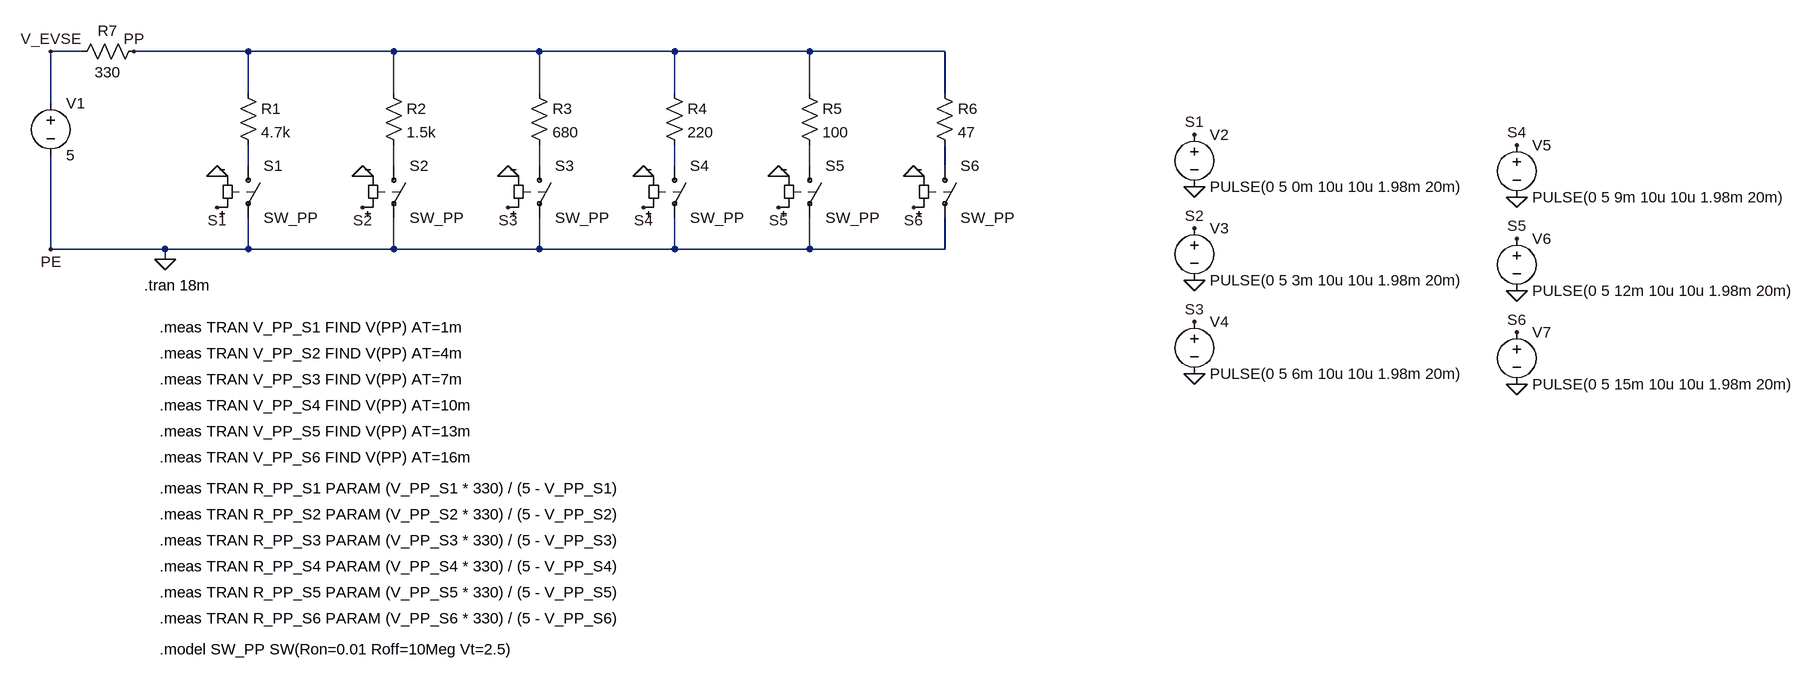
[diagram p0: schematic teste2.asc]
teste2.asc, the LTspice schematic file:
Version 4.1
SHEET 1 2472 920
WIRE -192 -16 -240 -16
WIRE 64 -16 -112 -16
WIRE 288 -16 64 -16
WIRE 512 -16 288 -16
WIRE 720 -16 512 -16
WIRE 928 -16 720 -16
WIRE 1136 -16 928 -16
WIRE 64 48 64 -16
WIRE 288 48 288 -16
WIRE 512 48 512 -16
WIRE 720 48 720 -16
WIRE 928 48 928 -16
WIRE 1136 48 1136 -16
WIRE -240 64 -240 -16
WIRE 64 160 64 128
WIRE 288 160 288 128
WIRE 512 160 512 128
WIRE 720 160 720 128
WIRE 928 160 928 128
WIRE 1136 160 1136 128
WIRE -240 288 -240 144
WIRE -64 288 -240 288
WIRE 64 288 64 240
WIRE 64 288 -64 288
WIRE 288 288 288 240
WIRE 288 288 64 288
WIRE 512 288 512 240
WIRE 512 288 288 288
WIRE 720 288 720 240
WIRE 720 288 512 288
WIRE 928 288 928 240
WIRE 928 288 720 288
WIRE 1136 288 1136 240
WIRE 1136 288 928 288
WIRE -64 304 -64 288
FLAG -64 304 0
FLAG -240 -16 V_EVSE
FLAG -112 -16 PP
FLAG -240 288 PE
FLAG 16 176 0
FLAG 240 176 0
FLAG 464 176 0
FLAG 672 176 0
FLAG 880 176 0
FLAG 1088 176 0
FLAG 1520 192 0
FLAG 1520 112 S1
FLAG 16 224 S1
FLAG 240 224 S2
FLAG 464 224 S3
FLAG 672 224 S4
FLAG 880 224 S5
FLAG 1088 224 S6
FLAG 1520 336 0
FLAG 1520 256 S2
FLAG 1520 480 0
FLAG 1520 400 S3
FLAG 2016 208 0
FLAG 2016 128 S4
FLAG 2016 352 0
FLAG 2016 272 S5
FLAG 2016 496 0
FLAG 2016 416 S6
SYMBOL voltage -240 48 R0
WINDOW 123 0 0 Left 0
WINDOW 39 0 0 Left 0
SYMATTR InstName V1
SYMATTR Value 5
SYMBOL res 48 32 R0
SYMATTR InstName R1
SYMATTR Value 4.7k
SYMBOL res 272 32 R0
SYMATTR InstName R2
SYMATTR Value 1.5k
SYMBOL res 496 32 R0
SYMATTR InstName R3
SYMATTR Value 680
SYMBOL res 704 32 R0
SYMATTR InstName R4
SYMATTR Value 220
SYMBOL res 912 32 R0
SYMATTR InstName R5
SYMATTR Value 100
SYMBOL res 1120 32 R0
SYMATTR InstName R6
SYMATTR Value 47
SYMBOL sw 64 144 R0
SYMATTR InstName S1
SYMATTR Value SW_PP
SYMBOL sw 288 144 R0
SYMATTR InstName S2
SYMATTR Value SW_PP
SYMBOL sw 512 144 R0
SYMATTR InstName S3
SYMATTR Value SW_PP
SYMBOL sw 720 144 R0
SYMATTR InstName S4
SYMATTR Value SW_PP
SYMBOL sw 928 144 R0
SYMATTR InstName S5
SYMATTR Value SW_PP
SYMBOL sw 1136 144 R0
SYMATTR InstName S6
SYMATTR Value SW_PP
SYMBOL voltage 1520 96 R0
WINDOW 123 0 0 Left 0
WINDOW 39 0 0 Left 0
SYMATTR InstName V2
SYMATTR Value PULSE(0 5 0m 10u 10u 1.98m 20m)
SYMBOL voltage 1520 240 R0
WINDOW 123 0 0 Left 0
WINDOW 39 0 0 Left 0
SYMATTR InstName V3
SYMATTR Value PULSE(0 5 3m 10u 10u 1.98m 20m)
SYMBOL voltage 1520 384 R0
WINDOW 123 0 0 Left 0
WINDOW 39 0 0 Left 0
SYMATTR InstName V4
SYMATTR Value PULSE(0 5 6m 10u 10u 1.98m 20m)
SYMBOL voltage 2016 112 R0
WINDOW 123 0 0 Left 0
WINDOW 39 0 0 Left 0
SYMATTR InstName V5
SYMATTR Value PULSE(0 5 9m 10u 10u 1.98m 20m)
SYMBOL voltage 2016 256 R0
WINDOW 123 0 0 Left 0
WINDOW 39 0 0 Left 0
SYMATTR InstName V6
SYMATTR Value PULSE(0 5 12m 10u 10u 1.98m 20m)
SYMBOL voltage 2016 400 R0
WINDOW 123 0 0 Left 0
WINDOW 39 0 0 Left 0
SYMATTR InstName V7
SYMATTR Value PULSE(0 5 15m 10u 10u 1.98m 20m)
SYMBOL res -96 -32 R90
WINDOW 0 0 56 VBottom 2
WINDOW 3 32 56 VTop 2
SYMATTR InstName R7
SYMATTR Value 330
TEXT -96 344 Left 2 !.tran 18m
TEXT -72 408 Left 2 !.meas TRAN V_PP_S1 FIND V(PP) AT=1m
TEXT -72 448 Left 2 !.meas TRAN V_PP_S2 FIND V(PP) AT=4m
TEXT -72 488 Left 2 !.meas TRAN V_PP_S3 FIND V(PP) AT=7m
TEXT -72 528 Left 2 !.meas TRAN V_PP_S4 FIND V(PP) AT=10m
TEXT -72 568 Left 2 !.meas TRAN V_PP_S5 FIND V(PP) AT=13m
TEXT -72 608 Left 2 !.meas TRAN V_PP_S6 FIND V(PP) AT=16m
TEXT -72 656 Left 2 !.meas TRAN R_PP_S1 PARAM (V_PP_S1 * 330) / (5 - V_PP_S1)
TEXT -72 696 Left 2 !.meas TRAN R_PP_S2 PARAM (V_PP_S2 * 330) / (5 - V_PP_S2)
TEXT -72 736 Left 2 !.meas TRAN R_PP_S3 PARAM (V_PP_S3 * 330) / (5 - V_PP_S3)
TEXT -72 776 Left 2 !.meas TRAN R_PP_S4 PARAM (V_PP_S4 * 330) / (5 - V_PP_S4)
TEXT -72 816 Left 2 !.meas TRAN R_PP_S5 PARAM (V_PP_S5 * 330) / (5 - V_PP_S5)
TEXT -72 856 Left 2 !.meas TRAN R_PP_S6 PARAM (V_PP_S6 * 330) / (5 - V_PP_S6)
TEXT -72 904 Left 2 !.model SW_PP SW(Ron=0.01 Roff=10Meg Vt=2.5)

The netlist it stands for:
* teste2.asc
V1 V_EVSE 0 5
R1 PP N001 4.7k
R2 PP N002 1.5k
R3 PP N003 680
R4 PP N004 220
R5 PP N005 100
R6 PP N006 47
S1 N001 0 S1 0 SW_PP
S2 N002 0 S2 0 SW_PP
S3 N003 0 S3 0 SW_PP
S4 N004 0 S4 0 SW_PP
S5 N005 0 S5 0 SW_PP
S6 N006 0 S6 0 SW_PP
V2 S1 0 PULSE(0 5 0m 10u 10u 1.98m 20m)
V3 S2 0 PULSE(0 5 3m 10u 10u 1.98m 20m)
V4 S3 0 PULSE(0 5 6m 10u 10u 1.98m 20m)
V5 S4 0 PULSE(0 5 9m 10u 10u 1.98m 20m)
V6 S5 0 PULSE(0 5 12m 10u 10u 1.98m 20m)
V7 S6 0 PULSE(0 5 15m 10u 10u 1.98m 20m)
R7 PP V_EVSE 330
.tran 18m
.meas TRAN V_PP_S1 FIND V(PP) AT=1m
.meas TRAN V_PP_S2 FIND V(PP) AT=4m
.meas TRAN V_PP_S3 FIND V(PP) AT=7m
.meas TRAN V_PP_S4 FIND V(PP) AT=10m
.meas TRAN V_PP_S5 FIND V(PP) AT=13m
.meas TRAN V_PP_S6 FIND V(PP) AT=16m
.meas TRAN R_PP_S1 PARAM (V_PP_S1 * 330) / (5 - V_PP_S1)
.meas TRAN R_PP_S2 PARAM (V_PP_S2 * 330) / (5 - V_PP_S2)
.meas TRAN R_PP_S3 PARAM (V_PP_S3 * 330) / (5 - V_PP_S3)
.meas TRAN R_PP_S4 PARAM (V_PP_S4 * 330) / (5 - V_PP_S4)
.meas TRAN R_PP_S5 PARAM (V_PP_S5 * 330) / (5 - V_PP_S5)
.meas TRAN R_PP_S6 PARAM (V_PP_S6 * 330) / (5 - V_PP_S6)
.model SW_PP SW(Ron=0.01 Roff=10Meg Vt=2.5)
.backanno
.end